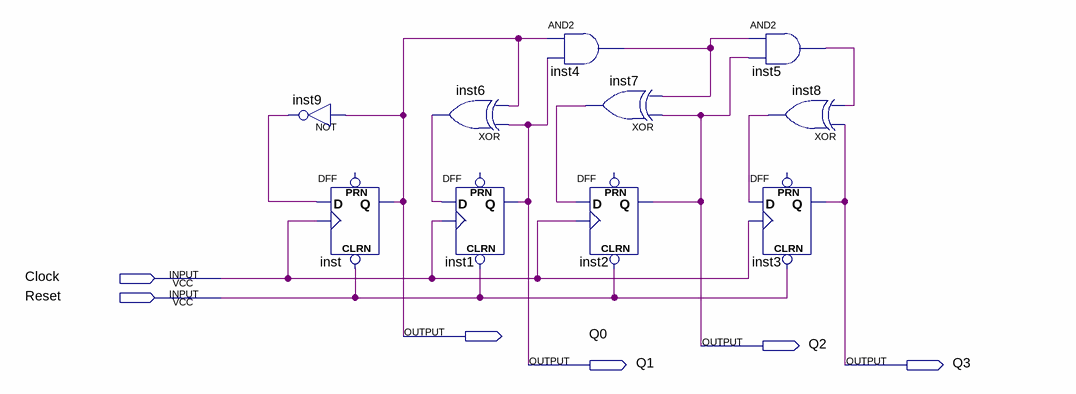
[diagram p0: schematic sheet]
// Quartus schematic SupCounter.bdf as structural Verilog: 10 symbols, 6 pins
module SupCounter (
  input  Clock,
  input  Reset,
  output Q0,
  output Q2,
  output Q1,
  output Q3
);

  wire inst4_out, inst5_out, inst6_out, inst7_out, inst8_out, inst9_out;

  not inst9 (inst9_out, Q0);
  DFF inst (.CLRN(Reset), .CLK(Clock), .D(inst9_out), .Q(Q0));  // open: PRN
  xor inst6 (inst6_out, Q1, Q0);
  DFF inst1 (.CLRN(Reset), .CLK(Clock), .D(inst6_out), .Q(Q1));  // open: PRN
  and inst4 (inst4_out, Q0, Q1);
  xor inst7 (inst7_out, Q2, inst4_out);
  DFF inst2 (.CLRN(Reset), .CLK(Clock), .D(inst7_out), .Q(Q2));  // open: PRN
  and inst5 (inst5_out, inst4_out, Q2);
  xor inst8 (inst8_out, Q3, inst5_out);
  DFF inst3 (.CLRN(Reset), .CLK(Clock), .D(inst8_out), .Q(Q3));  // open: PRN
endmodule
